# Altium schematic sheet Connectors.SchDoc
size A4
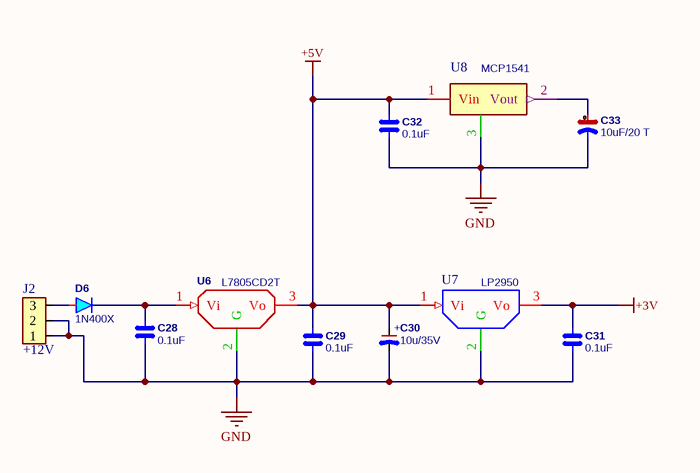
[diagram p0: Connectors.SchDoc]

## Parts
C28  0.1uF  [CC2012-0805]
C29  0.1uF  [CC2012-0805]
C30  10u/35V  [CESMD-B]
C31  0.1uF  [CC2012-0805]
C32  0.1uF  [CC2012-0805]
C33  10uF/20 T  [CC3216-1206]
D6  1N400X  [DO-41]
J2  +12V  [6410/3pin]
U6  L7805CD2T  [D2PAK]
U7  LP2950  [DPak-369C-01]
U8  MCP1541  [SOT-23]

## Nets
+3V: C31.2(C2) U7.3(Vo)
+5V: C29.2(C2) C30.1(+) C32.2(C2) U6.3(Vo) U7.1(Vi) U8.1(Vin)
GND: C28.1(C1) C29.1(C1) C30.2(-) C31.1(C1) C32.1(C1) C33.2(C2) J2.1 J2.2 U6.2(G) U7.2(G) U8.3(Vss)
NetC28_2: C28.2(C2) D6.2(K) U6.1(Vi)
NetC33_1: C33.1(C1) U8.2(Vout)
NetD6_1: D6.1(A) J2.3

## Library data of the parts
C28 C29 C31 C32 = C-SMD CER: Capacitor SMD ceramic; Part#: 399-1170-1-ND; Value: 0.1 uF/50V X7R; Type: C0805C104K5RACTU; Mfg.: Kemet; Supplier: Digi Key; Price: $0.054; Notes: *
C30 = CESMD: Capacitor Electrolytic SMD; Part#: PCE3413CT-ND; Mfg.: Panasonic; Type: EEV-FK1V100UR; Notes: *; Supplier: Digi Key; Value: 10u/35V; Price: $0.25
C33 = C-SMD TAN: Capacitor Tantal; Part#: 399-5152-1-ND; Value: 10uF/20V T 1206; Type: CAP TANT 10UF 20V 20% SMD; Mfg.: Kemet; Supplier: Digi Key; Price: $0.59; Notes: *
D6 = 1N400X: Rectifier diode; Value: *; Type: *; Mfg.: *; Supplier: *; Part#: *; Price: *; Notes: *
J2 = CON3: Connector 3 pin; Value: *; Type: *; Mfg.: *; Supplier: *; Part#: *; Price: *; Notes: *
U6 = L7805CD2T: Positive  voltage regulator 5V/1.5A; Part#: 497-1171-1-ND; Value: +5V/1.5A; Mfg.: ST Microelectronics; Type: L7805CD2T-TR; Supplier: Digi Key; Price: $1.09; Notes: *
U7 = LP2950-DPak: Positive  voltage regulator 3V/100mA; Part#: LP2950CDT-3.0RKGOSCT-ND; Value: +3V/100mA; Mfg.: ON Semiconductor; Type: LP2950CDT-3.0RKGOS; Supplier: Digi Key; Price: $1.07; Notes: *
U8 = MCP15xx: Voltage reference; Part#: MCP1541T-I/TTCT-ND; Value: Vr=4.096V; Mfg.: Microchip; Type: MCP1541T-I/TT; Supplier: Digi Key; Price: $1.04; Notes: *